# Altium project Dragonquad.PrjPCB
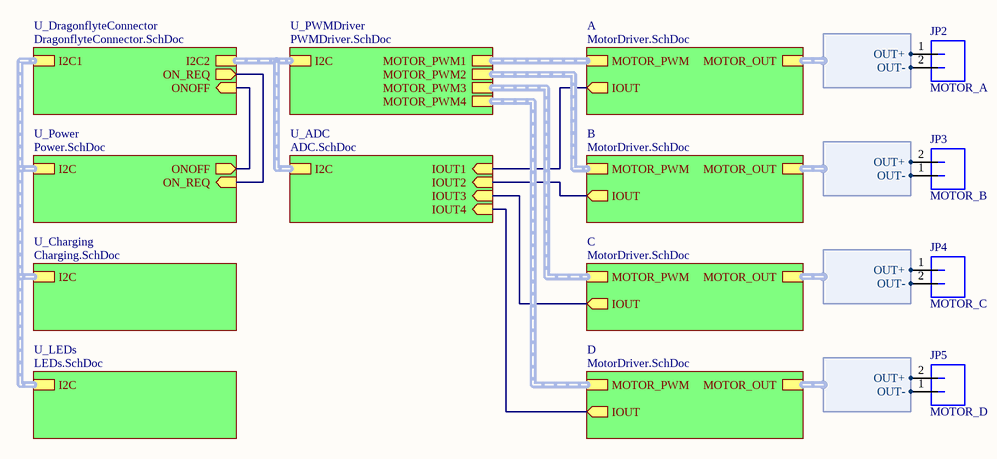
[diagram p0: Dragonquad.SchDoc]
8 sheets, 79 parts. Net scope: hierarchical (ports join the sheet entries above them; power ports are global).
Board file: Dragonquad.PcbDoc
Sheets:
  Dragonquad.SchDoc
    U_Power = Power.SchDoc
    U_DragonflyteConnector = DragonflyteConnector.SchDoc
    U_LEDs = LEDs.SchDoc
    U_PWMDriver = PWMDriver.SchDoc
    U_ADC = ADC.SchDoc
    U_Charging = Charging.SchDoc
    A = MotorDriver.SchDoc
    B = MotorDriver.SchDoc
    C = MotorDriver.SchDoc
    D = MotorDriver.SchDoc

## Sheet Dragonquad.SchDoc
size A

### Parts
JP2  MOTOR_A  [MOLEX-PICOBLADE-1.25MM-2-HORZ-SMD]
JP3  MOTOR_B  [MOLEX-PICOBLADE-1.25MM-2-HORZ-SMD]
JP4  MOTOR_C  [MOLEX-PICOBLADE-1.25MM-2-HORZ-SMD]
JP5  MOTOR_D  [MOLEX-PICOBLADE-1.25MM-2-HORZ-SMD]

### Sub-sheets
A = MotorDriver.SchDoc: MOTOR_PWM (harness MotorPWM), MOTOR_OUT (harness MotorOut), IOUT (out)
B = MotorDriver.SchDoc: MOTOR_PWM (harness MotorPWM), MOTOR_OUT (harness MotorOut), IOUT (out)
C = MotorDriver.SchDoc: MOTOR_PWM (harness MotorPWM), MOTOR_OUT (harness MotorOut), IOUT (out)
D = MotorDriver.SchDoc: MOTOR_PWM (harness MotorPWM), MOTOR_OUT (harness MotorOut), IOUT (out)
U_ADC = ADC.SchDoc: I2C (harness I2C), IOUT1 (in), IOUT2 (in), IOUT3 (in), IOUT4 (in)
U_Charging = Charging.SchDoc: I2C (harness I2C)
U_DragonflyteConnector = DragonflyteConnector.SchDoc: ONOFF (in), ON_REQ (out), I2C1 (harness I2C), I2C2 (harness I2C)
U_LEDs = LEDs.SchDoc: I2C (harness I2C)
U_Power = Power.SchDoc: ONOFF (out), ON_REQ (in), I2C (harness I2C)
U_PWMDriver = PWMDriver.SchDoc: I2C (harness I2C), MOTOR_PWM1 (harness MotorPWM), MOTOR_PWM2 (harness MotorPWM), MOTOR_PWM3 (harness MotorPWM), MOTOR_PWM4 (harness MotorPWM)

### Harnesses
MotorOut: OUT+, OUT-

### Nets
NetD6_1: sheet U_Power/ONOFF, sheet U_DragonflyteConnector/ONOFF
NetJP1_30: sheet U_Power/ON_REQ, sheet U_DragonflyteConnector/ON_REQ
NetJP2_1: JP2.1 ; sheet A/MOTOR_OUT.OUT+
NetJP2_2: JP2.2 ; sheet A/MOTOR_OUT.OUT-
NetJP3_1: JP3.1 ; sheet B/MOTOR_OUT.OUT-
NetJP3_2: JP3.2 ; sheet B/MOTOR_OUT.OUT+
NetJP4_1: JP4.1 ; sheet C/MOTOR_OUT.OUT+
NetJP4_2: JP4.2 ; sheet C/MOTOR_OUT.OUT-
NetJP5_1: JP5.1 ; sheet D/MOTOR_OUT.OUT-
NetJP5_2: JP5.2 ; sheet D/MOTOR_OUT.OUT+
NetR6_A_2: sheet U_ADC/IOUT1, sheet A/IOUT
NetR6_B_2: sheet U_ADC/IOUT2, sheet B/IOUT
NetR6_C_2: sheet U_ADC/IOUT3, sheet C/IOUT
NetR6_D_2: sheet U_ADC/IOUT4, sheet D/IOUT

### Buses and harness runs
harness sheet A/MOTOR_PWM = sheet U_PWMDriver/MOTOR_PWM1
harness sheet B/MOTOR_PWM = sheet U_PWMDriver/MOTOR_PWM2
harness sheet C/MOTOR_PWM = sheet U_PWMDriver/MOTOR_PWM3
harness sheet D/MOTOR_PWM = sheet U_PWMDriver/MOTOR_PWM4
harness sheet U_ADC/I2C = sheet U_DragonflyteConnector/I2C2 = sheet U_PWMDriver/I2C
harness sheet U_Charging/I2C = sheet U_DragonflyteConnector/I2C1 = sheet U_LEDs/I2C = sheet U_Power/I2C

### Library data of the parts
JP2-JP5 = MOLEX_PICOBLADE_1.25MM_2_HORZ_SMD: Manufacturer: Molex; PartNumber: 53261-0271; Mounting Technology: Surface Mount; PackageReference: PicoBlade-1.25mm

## Sheet Power.SchDoc
size A
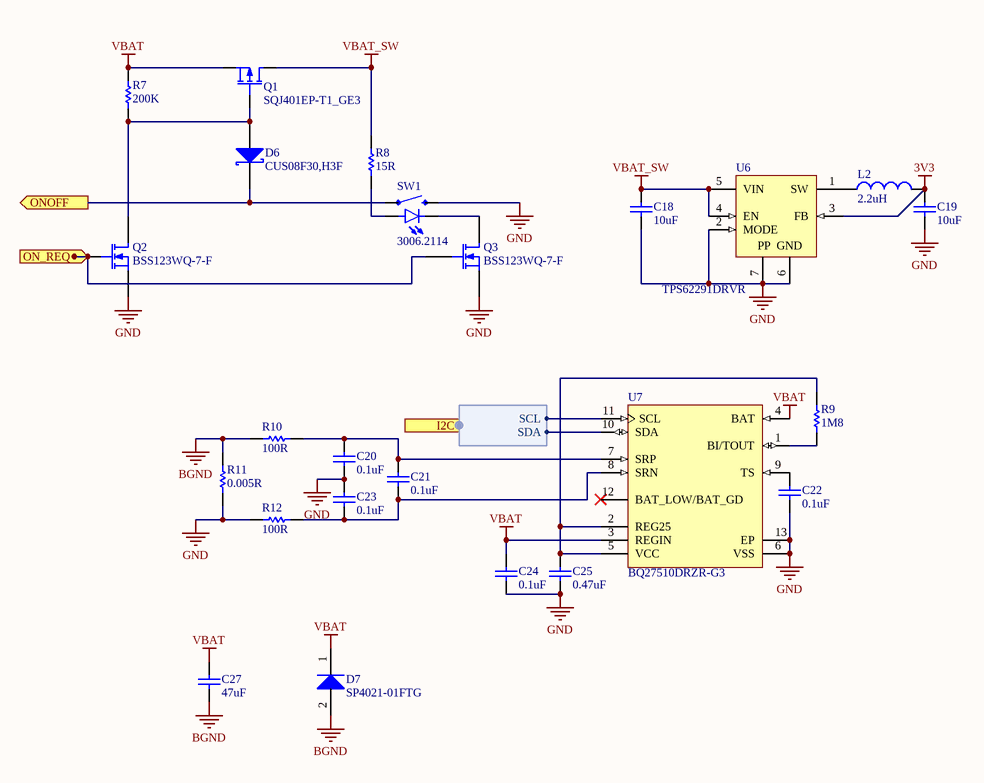
[diagram p1: Power.SchDoc]

### Parts
C18  value 10uF  [C0402[1005X55]]  (hidden comment: 10uF 6.3V 0402)
C19  value 10uF  [C0402[1005X55]]  (hidden comment: 10uF 6.3V 0402)
C20  value 0.1uF  [C0402[1005X55]]  (hidden comment: 0.1uF 6.3V 0402)
C21  value 0.1uF  [C0402[1005X55]]  (hidden comment: 0.1uF 6.3V 0402)
C22  value 0.1uF  [C0402[1005X55]]  (hidden comment: 0.1uF 6.3V 0402)
C23  value 0.1uF  [C0402[1005X55]]  (hidden comment: 0.1uF 6.3V 0402)
C24  value 0.1uF  [C0402[1005X55]]  (hidden comment: 0.1uF 6.3V 0402)
C25  value 0.47uF  [C0402[1005X55]]  (hidden comment: 0.47uF 25V 0402)
C27  value 47uF  [C1206[3216X160]]  (hidden comment: 47uF 6.3V 1206)
D6  CUS08F30,H3F  [SOD-323]
D7  SP4021-01FTG  [SOD-323]
L2  2.2uH  [IND0805]
Q1  SQJ401EP-T1_GE3  [PowerPak-8]
Q2  BSS123WQ-7-F  [SOT323-3]
Q3  BSS123WQ-7-F  [SOT323-3]
R7  value 200K  [R0402[1005]]  (hidden comment: 200K 1% 0402)
R8  value 15R  [R0402[1005]]  (hidden comment: 15R 1% 0402)
R9  value 1M8  [R0402[1005]]  (hidden comment: 1M8 1% 0402)
R10  value 100R  [R0402[1005]]  (hidden comment: 100R 1% 0402)
R11  value 0.005R  [R2512[6432]]  (hidden comment: 0.005R 1% 2512)
R12  value 100R  [R0402[1005]]  (hidden comment: 100R 1% 0402)
SW1  3006.2114  [PCBComponent_1]
U6  TPS62291DRVR  [WSON-6]
U7  BQ27510DRZR-G3  [VSON-12]

### Ports
I2C (harness I2C), ON_REQ (in), ONOFF (out)

### Harnesses
I2C: SCL, SDA

### Nets
3V3: C19.2 L2.2 U6.3(FB)
BGND: C27.1 D7.2(A) R10.1 R11.2
GND: C18.1 C19.1 C20.1 C22.1 C23.2 C24.1 C25.1 Q2.2(S) Q3.2(S) R11.1 R12.1 SW1.2 U6.2(MODE) U6.6(GND) U6.7(EP) U7.6(VSS) U7.13(EP)
VBAT: C24.2 C27.2 D7.1(K) Q1.1(S) R7.2 U7.3(REGIN) U7.4(BAT)
VBAT_SW: C18.2 Q1.3(D) R8.2 U6.4(EN) U6.5(VIN)
NetC20_2: C20.2 C21.2 R10.2 U7.7(SRP)
NetC21_1: C21.1 C23.1 R12.2 U7.8(SRN)
NetC22_2: C22.2 U7.9(TS)
NetC25_2: C25.2 R9.2 U7.2(REG25) U7.5(VCC)
NetD6_1: D6.1(K) SW1.1 ; port ONOFF
NetD6_2: D6.2(A) Q1.2(G) Q2.3(D) R7.1
NetJP1_30: Q2.1(G) Q3.1(G) ; port ON_REQ
NetJP1_33: U7.11(SCL) ; port I2C.SCL
NetJP1_34: U7.10(SDA) ; port I2C.SDA
NetL2_1: L2.1 U6.1(SW)
NetQ3_3: Q3.3(D) SW1.K
NetR8_1: R8.1 SW1.A
NetR9_1: R9.1 U7.1(BI/TOUT)

Not connected (* = marked no-connect by the designer): U7 12(BAT_LOW/BAT_GD)*

### Notes on the sheet
- (in symbol TPS62291DRVR) PP

### Library data of the parts
C18 C19 = CAP_10uF_6.3V_0402_20%: 10uF 6.3V 20% 0402 (1005 Metric); PartNumber: GRM155R60J106ME44D; Manufacturer: Murata; Tolerance: 20%; Mounting Technology: Surface Mount; PackageReference: 0402; PackageDescription: 0402 (1005 Metric); Voltage: 6.3V
C20-C24 = CAP_0.1uF_6.3V_0402_10%: 0.1uF 6.3V 10% 0402 (1005 Metric); PartNumber: GRM155R70J104KA01D; Manufacturer: Murata; Mounting Technology: Surface Mount; PackageReference: 0402; PackageDescription: 0402 (1005 Metric); Voltage: 6.3V; Tolerance: 10%
C25 = CAP_0.47uF_25V_0402_10%: 0.47uF 25V 10% 0402 (1005 Metric); PartNumber: GRM155R61E474KE01D; Manufacturer: Murata; Mounting Technology: Surface Mount; PackageReference: 0402; PackageDescription: 0402 (1005 Metric); Voltage: 25V; Tolerance: 10%
C27 = CAP_47uF_6.3V_1206_10%: 47uF 6.3V 10% 1206 (3216 Metric); PartNumber: GRM31CR60J476KE19L; Manufacturer: Murata; Mounting Technology: Surface Mount; PackageReference: 1206; PackageDescription: 1206 (3216 Metric); Voltage: 6.3V; Tolerance: 10%
D6 = CUS08F30,H3F: Manufacturer: Toshiba; PackageReference: SOD-323; PartNumber: CUS08F30,H3F; Mounting Technology: Surface Mount
D7 = SP4021-01FTG: Manufacturer: Littelfuse; PartNumber: SP4021-01FTG; PackageReference: SOD-323-2; Mounting Technology: Surface Mount
L2 = IND_2.2uH_1.7A_0805_20%: 2.2uH 20% 1.7A 0805; PartNumber: LQM21PN2R2MGHL; Manufacturer: Murata; PackageReference: 0805; PackageDescription: 0805 (2012 metric); Value: 2.2uH; Mounting Technology: Surface Mount; Current: 1.7A
Q1 = SQJ401EP-T1_GE3: P-Channel MOSFET; Manufacturer: Vishay; PartNumber: SQJ401EP-T1_GE3; Mounting Technology: Surface Mount; PackageReference: PowerPAK SO-8
Q2 Q3 = BSS123WQ-7-F: N-Channel MOSFET; Manufacturer: Diodes Incorporated; PartNumber: BSS123WQ-7-F; PackageReference: SOT-323-3; Mounting Technology: Surface Mount
R7 = RES_200K_0402_1%: 200K 0.063W 1% 0402 (1005 Metric); Manufacturer: KOA Speer; PartNumber: RK73H1ETTP2003F; Tolerance: 1%; Power: 0.063W; Mounting Technology: Surface Mount; PackageReference: 0402; PackageDescription: 0402 (1005 Metric); ComponentLink1Description: Datasheet; ComponentLink1URL: http://www.koaspeer.com/catimages/Products/RK73H/RK73H.pdf
R8 = RES_15R_0402_1%: 15R 0.063W 1% 0402 (1005 Metric); Manufacturer: KOA Speer; PartNumber: RK73H1ETTP15R0F; Tolerance: 1%; Power: 0.063W; Mounting Technology: Surface Mount; PackageReference: 0402; PackageDescription: 0402 (1005 Metric); ComponentLink1Description: Datasheet; ComponentLink1URL: http://www.koaspeer.com/catimages/Products/RK73H/RK73H.pdf
R9 = RES_1M8_0402_1%: 1M8 0.063W 1% 0402 (1005 Metric); Manufacturer: KOA Speer; PartNumber: RK73H1ETTP1804F; Tolerance: 1%; Power: 0.063W; Mounting Technology: Surface Mount; PackageReference: 0402; PackageDescription: 0402 (1005 Metric); ComponentLink1Description: Datasheet; ComponentLink1URL: http://www.koaspeer.com/catimages/Products/RK73H/RK73H.pdf
R10 R12 = RES_100R_0402_1%: 100R 0.063W 1% 0402 (1005 Metric); Manufacturer: KOA Speer; PartNumber: RK73H1ETTP1000F; Tolerance: 1%; Power: 0.063W; Mounting Technology: Surface Mount; PackageReference: 0402; PackageDescription: 0402 (1005 Metric); ComponentLink1Description: Datasheet; ComponentLink1URL: http://www.koaspeer.com/catimages/Products/RK73H/RK73H.pdf
R11 = RES_0.005R_2512_1%: 0.005R 2.5W 1% 2512 (6432 Metric); Manufacturer: Riedon; PartNumber: CSR2512B0R005F; Tolerance: 1%; Power: 2.5W; Mounting Technology: Surface Mount; PackageReference: 2512; PackageDescription: 2512 (6432 Metric); ComponentLink1Description: Datasheet; ComponentLink1URL: https://industrial.panasonic.com/cdbs/www-data/pdf/RDA0000/AOA0000C239.pdf
SW1 = 3006.2114: Manufacturer: Marquadt; PartNumber: 3006.2114; Mounting Technology: Surface Mount
U6 = TPS62291DRVR: Voltage Regulators - Switching Regulators 2.25MHz 1A Step-Down Cnvrtr 3.3V Output; Manufacturer: Texas Instruments; PartNumber: TPS62291DRVR; PackageReference: WSON-6; PackageDescription: SON, 6-Leads, Body 2x2mm, Pitch 0.65mm, Thermal Pad 1.6x1mm, TI Recommended; Mounting Technology: Surface Mount
U7 = BQ27510DRZR-G3: Battery Management System-Side Impedance Track Fuel Gauge; Manufacturer: Texas Instruments; PartNumber: BQ27510DRZR-G3; PackageReference: VSON-12; Mounting Technology: Surface Mount

## Sheet DragonflyteConnector.SchDoc
size A
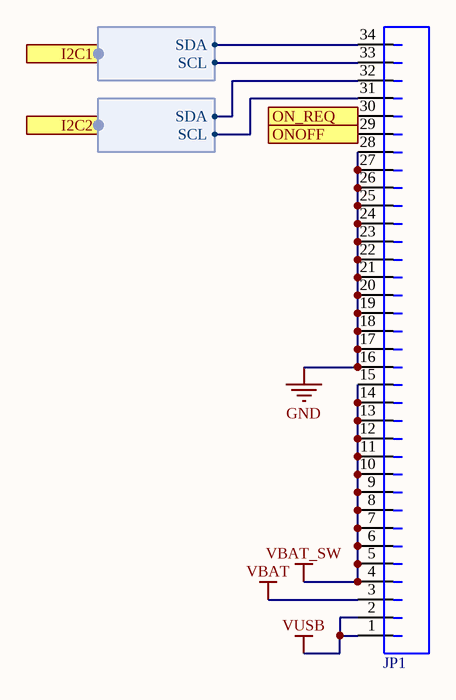
[diagram p2: DragonflyteConnector.SchDoc]

### Parts
JP1  MOLEX_FFC-FPC_34  [MOLEX-FFC-FPC-0.5MM-34]  (value not drawn)

### Ports
I2C1 (harness I2C), I2C2 (harness I2C), ON_REQ (out), ONOFF (in)

### Harnesses
I2C: SCL, SDA

### Nets
GND: JP1.16 JP1.17 JP1.18 JP1.19 JP1.20 JP1.21 JP1.22 JP1.23 JP1.24 JP1.25 JP1.26 JP1.27 JP1.28
VBAT: JP1.3
VBAT_SW: JP1.4 JP1.5 JP1.6 JP1.7 JP1.8 JP1.9 JP1.10 JP1.11 JP1.12 JP1.13 JP1.14 JP1.15
VUSB: JP1.1 JP1.2
NetD6_1: JP1.29 ; port ONOFF
NetJP1_30: JP1.30 ; port ON_REQ
NetJP1_31: JP1.31 ; port I2C2.SCL
NetJP1_32: JP1.32 ; port I2C2.SDA
NetJP1_33: JP1.33 ; port I2C1.SCL
NetJP1_34: JP1.34 ; port I2C1.SDA

### Library data of the parts
JP1 = MOLEX_FFC-FPC_34: Manufacturer: Molex; PartNumber: 51296-3494; System: Connector; PackageReference: FFC-FPC-0.5; Mounting Technology: Surface Mount

## Sheet LEDs.SchDoc
size A
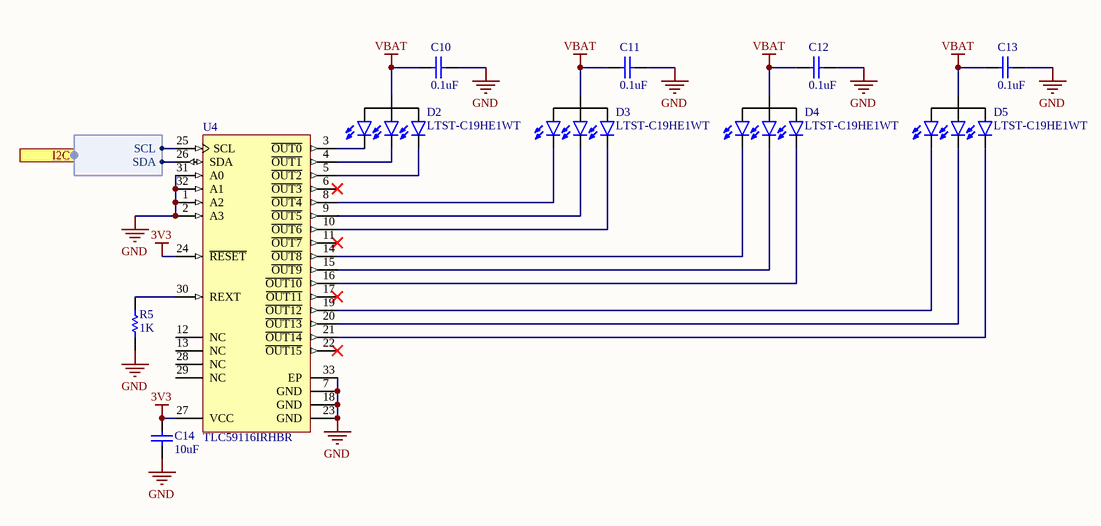
[diagram p3: LEDs.SchDoc]

### Parts
C10  value 0.1uF  [C0402[1005X55]]  (hidden comment: 0.1uF 6.3V 0402)
C11  value 0.1uF  [C0402[1005X55]]  (hidden comment: 0.1uF 6.3V 0402)
C12  value 0.1uF  [C0402[1005X55]]  (hidden comment: 0.1uF 6.3V 0402)
C13  value 0.1uF  [C0402[1005X55]]  (hidden comment: 0.1uF 6.3V 0402)
C14  value 10uF  [C0402[1005X55]]  (hidden comment: 10uF 6.3V 0402)
D2  LTST-C19HE1WT  [LED0606]
D3  LTST-C19HE1WT  [LED0606]
D4  LTST-C19HE1WT  [LED0606]
D5  LTST-C19HE1WT  [LED0606]
R5  value 1K  [R0402[1005]]  (hidden comment: 1K 1% 0402)
U4  TLC59116IRHBR  [VQFN-32]

### Ports
I2C (harness I2C)

### Harnesses
I2C: SCL, SDA

### Nets
3V3: C14.2 U4.24(~{RESET}) U4.27(VCC)
GND: C10.2 C11.2 C12.2 C13.2 C14.1 R5.1 U4.1(A2) U4.2(A3) U4.7(GND) U4.18(GND) U4.23(GND) U4.31(A0) U4.32(A1) U4.33(EP)
VBAT: C10.1 C11.1 C12.1 C13.1 D2.4(A) D3.4(A) D4.4(A) D5.4(A)
NetD2_1: D2.1(K_Red) U4.3(~{OUT0})
NetD2_2: D2.2(K_Green) U4.4(~{OUT1})
NetD2_3: D2.3(K_Blue) U4.5(~{OUT2})
NetD3_1: D3.1(K_Red) U4.8(~{OUT4})
NetD3_2: D3.2(K_Green) U4.9(~{OUT5})
NetD3_3: D3.3(K_Blue) U4.10(~{OUT6})
NetD4_1: D4.1(K_Red) U4.14(~{OUT8})
NetD4_2: D4.2(K_Green) U4.15(~{OUT9})
NetD4_3: D4.3(K_Blue) U4.16(~{OUT10})
NetD5_1: D5.1(K_Red) U4.19(~{OUT12})
NetD5_2: D5.2(K_Green) U4.20(~{OUT13})
NetD5_3: D5.3(K_Blue) U4.21(~{OUT14})
NetJP1_33: U4.25(SCL) ; port I2C.SCL
NetJP1_34: U4.26(SDA) ; port I2C.SDA
NetR5_2: R5.2 U4.30(REXT)

Not connected (* = marked no-connect by the designer): U4 6(~{OUT3})* 11(~{OUT7})* 12(NC) 13(NC) 17(~{OUT11})* 22(~{OUT15})* 28(NC) 29(NC)

### Library data of the parts
C10-C13 = CAP_0.1uF_6.3V_0402_10%: as C20 on sheet Power; Mounting Technology: Surface Mount; PackageReference: 0402; PackageDescription: 0402 (1005 Metric); Voltage: 6.3V; Tolerance: 10%
C14 = CAP_10uF_6.3V_0402_20%: as C18 on sheet Power; Mounting Technology: Surface Mount; PackageReference: 0402; PackageDescription: 0402 (1005 Metric); Voltage: 6.3V; Tolerance: 20%
D2-D5 = LTST-C19HE1WT: Manufacturer: Lite-On Inc.; PartNumber: LTST-C19HE1WT; PackageReference: 0606; Mounting Technology: Surface Mount; PackageDescription: 0606 (1616 Metric)
R5 = RES_1K_0402_1%: 1K 0.063W 1% 0402 (1005 Metric); Manufacturer: KOA Speer; PartNumber: RK73H1ETTP1001F; Tolerance: 1%; Power: 0.063W; Mounting Technology: Surface Mount; PackageReference: 0402; PackageDescription: 0402 (1005 Metric); ComponentLink1Description: Datasheet; ComponentLink1URL: http://www.koaspeer.com/catimages/Products/RK73H/RK73H.pdf
U4 = TLC59116IRHBR: IC LED DRVR LIN DIM 120MA 32VQFN; Manufacturer: Texas Instruments; PartNumber: TLC59116IRHBR; PackageReference: QFN-32; Mounting Technology: Surface Mount

## Sheet PWMDriver.SchDoc
size A
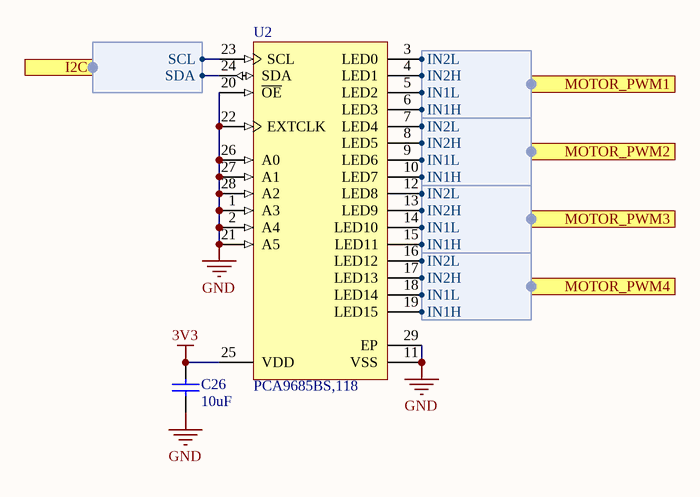
[diagram p4: PWMDriver.SchDoc]

### Parts
C26  value 10uF  [C0402[1005X55]]  (hidden comment: 10uF 6.3V 0402)
U2  PCA9685BS,118  [VQFN-28]

### Ports
I2C (harness I2C), MOTOR_PWM1 (harness MotorPWM), MOTOR_PWM2 (harness MotorPWM), MOTOR_PWM3 (harness MotorPWM), MOTOR_PWM4 (harness MotorPWM)

### Harnesses
I2C: SCL, SDA
MotorPWM: IN1H, IN1L, IN2H, IN2L

### Nets
3V3: C26.2 U2.25(VDD)
GND: C26.1 U2.1(A3) U2.2(A4) U2.11(VSS) U2.20(~{OE}) U2.21(A5) U2.22(EXTCLK) U2.26(A0) U2.27(A1) U2.28(A2) U2.29(EP)
NetJP1_31: U2.23(SCL) ; port I2C.SCL
NetJP1_32: U2.24(SDA) ; port I2C.SDA
NetU2_3: U2.3(LED0) ; port MOTOR_PWM1.IN2L
NetU2_4: U2.4(LED1) ; port MOTOR_PWM1.IN2H
NetU2_5: U2.5(LED2) ; port MOTOR_PWM1.IN1L
NetU2_6: U2.6(LED3) ; port MOTOR_PWM1.IN1H
NetU2_7: U2.7(LED4) ; port MOTOR_PWM2.IN2L
NetU2_8: U2.8(LED5) ; port MOTOR_PWM2.IN2H
NetU2_9: U2.9(LED6) ; port MOTOR_PWM2.IN1L
NetU2_10: U2.10(LED7) ; port MOTOR_PWM2.IN1H
NetU2_12: U2.12(LED8) ; port MOTOR_PWM3.IN2L
NetU2_13: U2.13(LED9) ; port MOTOR_PWM3.IN2H
NetU2_14: U2.14(LED10) ; port MOTOR_PWM3.IN1L
NetU2_15: U2.15(LED11) ; port MOTOR_PWM3.IN1H
NetU2_16: U2.16(LED12) ; port MOTOR_PWM4.IN2L
NetU2_17: U2.17(LED13) ; port MOTOR_PWM4.IN2H
NetU2_18: U2.18(LED14) ; port MOTOR_PWM4.IN1L
NetU2_19: U2.19(LED15) ; port MOTOR_PWM4.IN1H

### Library data of the parts
C26 = CAP_10uF_6.3V_0402_20%: as C18 on sheet Power; Mounting Technology: Surface Mount; PackageReference: 0402; PackageDescription: 0402 (1005 Metric); Voltage: 6.3V; Tolerance: 20%
U2 = PCA9685BS,118: IC LED DRVR LIN DIM 25MA 28HVQFN; Manufacturer: NXP; PartNumber: PCA9685BS,118; PackageReference: QFN-28; Mounting Technology: Surface Mount

## Sheet ADC.SchDoc
size A
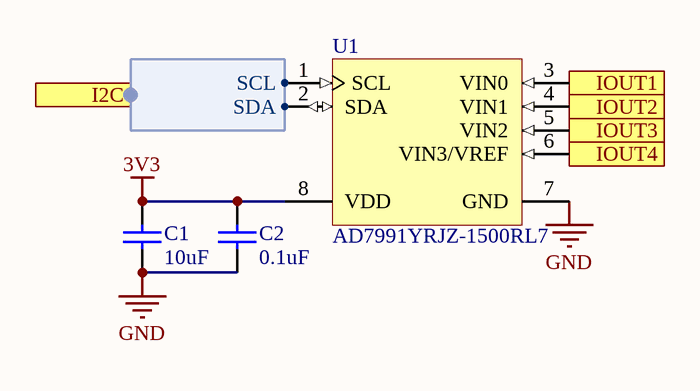
[diagram p5: ADC.SchDoc]

### Parts
C1  value 10uF  [C0402[1005X55]]  (hidden comment: 10uF 6.3V 0402)
C2  value 0.1uF  [C0402[1005X55]]  (hidden comment: 0.1uF 6.3V 0402)
U1  AD7991YRJZ-1500RL7  [RJ-8_M]

### Ports
I2C (harness I2C), IOUT1 (in), IOUT2 (in), IOUT3 (in), IOUT4 (in)

### Harnesses
I2C: SCL, SDA

### Nets
3V3: C1.2 C2.2 U1.8(VDD)
GND: C1.1 C2.1 U1.7(GND)
NetJP1_31: U1.1(SCL) ; port I2C.SCL
NetJP1_32: U1.2(SDA) ; port I2C.SDA
NetR6_A_2: U1.3(VIN0) ; port IOUT1
NetR6_B_2: U1.4(VIN1) ; port IOUT2
NetR6_C_2: U1.5(VIN2) ; port IOUT3
NetR6_D_2: U1.6(VIN3/VREF) ; port IOUT4

### Library data of the parts
C1 = CAP_10uF_6.3V_0402_20%: as C18 on sheet Power; Mounting Technology: Surface Mount; PackageReference: 0402; PackageDescription: 0402 (1005 Metric); Voltage: 6.3V; Tolerance: 20%
C2 = CAP_0.1uF_6.3V_0402_10%: as C20 on sheet Power; Mounting Technology: Surface Mount; PackageReference: 0402; PackageDescription: 0402 (1005 Metric); Voltage: 6.3V; Tolerance: 10%
U1 = CMP-0313-01614-2: Quad 12-Bit Analog-to-Digital Converter with I2C, Serial 2-Wire Interface, 140KSPS, -40 to +125 degC, RJ-8, Pb-Free, Reel; Generic Part Number: AD7991; Manufacturer: Analog Devices; Resolution (Bits): 12; Throughput Rate (SPS): 140K; Channels: 4; Interface: I2C/Ser 2-Wire; DatasheetVersion: Rev.B; ComponentLink1Description: Manufacturer URL; ComponentLink3Description: Package Specification; ComponentLink1URL: http://www.analog.com/en/index.html; ComponentLink2URL: http://www.analog.com/static/imported-files/data_sheets/AD7991_7995_7999.pdf; ComponentLink4Description: Product URL; Code_JEDEC: MO-178-BA; PartNumber: AD7991YRJZ-1500RL7; Mounting Technology: Surface Mount; PackageReference: RJ-8; PackageDescription: 8-Lead Thin Small Outline Transistor Package [SOT-23]; ComponentLink4URL: http://www.analog.com/en/analog-to-digital-converters/ad-converters/ad7991/products/product.html; Packing: Reel; PackageVersion: 121608-A; RoHS: Y; ComponentLink3URL: http://www.analog.com/static/imported-files/packages/PKG_PDF/SOT-23(RJ)/RJ_8.pdf; ComponentLink2Description: Datasheet

## Sheet Charging.SchDoc
size A
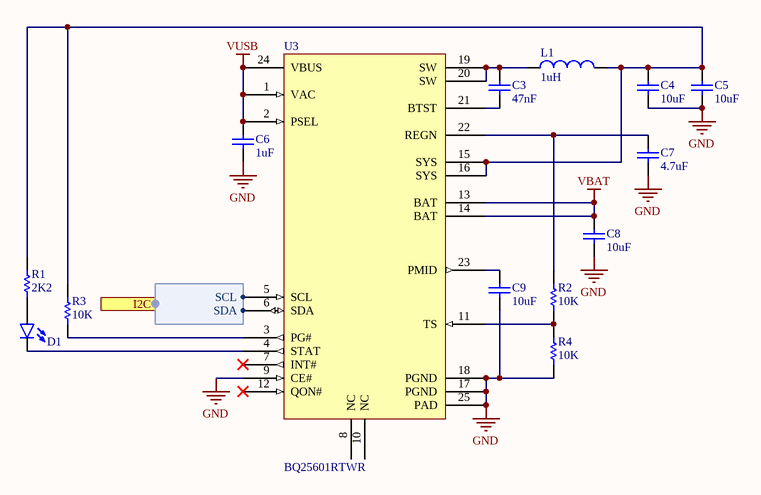
[diagram p6: Charging.SchDoc]

### Parts
C3  value 47nF  [C0402[1005X55]]  (hidden comment: 47nF 16V 0402)
C4  value 10uF  [C0402[1005X55]]  (hidden comment: 10uF 6.3V 0402)
C5  value 10uF  [C0402[1005X55]]  (hidden comment: 10uF 6.3V 0402)
C6  value 1uF  [C0402[1005X55]]  (hidden comment: 1uF 16V 0402)
C7  value 4.7uF  [C0402[1005X55]]  (hidden comment: 4.7uF 10V 0402)
C8  value 10uF  [C0402[1005X55]]  (hidden comment: 10uF 6.3V 0402)
C9  value 10uF  [C0603[1608X92]]  (hidden comment: 10uF 35V 0603)
D1  LED_0603_GREEN_5mA  [LED0603]  (value not drawn)
L1  1uH  [IND1008]
R1  value 2K2  [R0402[1005]]  (hidden comment: 2K2 1% 0402)
R2  value 10K  [R0402[1005]]  (hidden comment: 10K 1% 0402)
R3  value 10K  [R0402[1005]]  (hidden comment: 10K 1% 0402)
R4  value 10K  [R0402[1005]]  (hidden comment: 10K 1% 0402)
U3  BQ25601RTWR  [WQFN-24]

### Ports
I2C (harness I2C)

### Harnesses
I2C: SCL, SDA

### Nets
GND: C4.1 C5.1 C6.1 C7.1 C8.1 C9.1 R4.1 U3.9(CE#) U3.17(PGND) U3.18(PGND) U3.25(PAD)
VBAT: C8.2 U3.13(BAT) U3.14(BAT)
VUSB: C6.2 U3.1(VAC) U3.2(PSEL) U3.24(VBUS)
NetC3_1: C3.1 U3.21(BTST)
NetC3_2: C3.2 L1.1 U3.19(SW) U3.20(SW)
NetC4_2: C4.2 C5.2 L1.2 R1.2 R3.2 U3.15(SYS) U3.16(SYS)
NetC7_2: C7.2 R2.2 U3.22(REGN)
NetC9_2: C9.2 U3.23(PMID)
NetD1_A: D1.A R1.1
NetD1_C: D1.C U3.4(STAT)
NetJP1_33: U3.5(SCL) ; port I2C.SCL
NetJP1_34: U3.6(SDA) ; port I2C.SDA
NetR2_1: R2.1 R4.2 U3.11(TS)
NetR3_1: R3.1 U3.3(PG#)

Not connected (* = marked no-connect by the designer): U3 7(INT#)* 8(NC) 10(NC) 12(QON#)*

### Library data of the parts
C3 = CAP_47nF_16V_0402_10%: 47nF 16V 10% 0402 (1005 Metric); PartNumber: GCM155R71C473KA37D; Manufacturer: Murata; Mounting Technology: Surface Mount; PackageReference: 0402; PackageDescription: 0402 (1005 Metric); Voltage: 16V; Tolerance: 10%
C4 C5 C8 = CAP_10uF_6.3V_0402_20%: as C18 on sheet Power; Mounting Technology: Surface Mount; PackageReference: 0402; PackageDescription: 0402 (1005 Metric); Voltage: 6.3V; Tolerance: 20%
C6 = CAP_1uF_16V_0402_10%: 1uF 16V 10% 0402 (1005 Metric); PartNumber: GRM155R61C105KE01D; Manufacturer: Murata; Mounting Technology: Surface Mount; PackageReference: 0402; PackageDescription: 0402 (1005 Metric); Voltage: 16V; Tolerance: 10%
C7 = CAP_4.7uF_10V_0402_10%: 4.7uF 10V 10% 0402 (1005 Metric); PartNumber: ZRB15XR61A475KE01D; Manufacturer: Murata; Mounting Technology: Surface Mount; PackageReference: 0402; PackageDescription: 0402 (1005 Metric); Voltage: 10V; Tolerance: 10%
C9 = CAP_10uF_35V_0603_10%: 10uF 35V 10% 0603 (1608 Metric); PartNumber: GRM188R6YA106MA73D; Manufacturer: Murata; Mounting Technology: Surface Mount; PackageReference: 0603; PackageDescription: 0603 (1608 Metric); Voltage: 35V; Tolerance: 10%
D1 = LED_0603_GREEN_5mA: PartNumber: LTST-C193TGKT-5A; Manufacturer: Lite-On Inc.; PackageReference: 0603; PackageDescription: 0603 (1608 Metric); Mounting Technology: Surface Mount
L1 = IND_1uH_4.7A_1008_20%: 1uH 20% 4.7A 1008; PartNumber: DFE252012F-2R2M=P2; Manufacturer: Murata; PackageReference: 1008; PackageDescription: 1008 (2520 metric); Mounting Technology: Surface Mount; Current: 4.7A; Value: 1uH
R1 = RES_2K2_0402_1%: 2K2 0.063W 1% 0402 (1005 Metric); Manufacturer: KOA Speer; PartNumber: RK73H1ETTP2201F; Tolerance: 1%; Power: 0.063W; Mounting Technology: Surface Mount; PackageReference: 0402; PackageDescription: 0402 (1005 Metric); ComponentLink1Description: Datasheet; ComponentLink1URL: http://www.koaspeer.com/catimages/Products/RK73H/RK73H.pdf
R2-R4 = RES_10K_0402_1%: 10K 0.063W 1% 0402 (1005 Metric); Manufacturer: KOA Speer; PartNumber: RK73H1ETTP1002F; Tolerance: 1%; Power: 0.063W; Mounting Technology: Surface Mount; PackageReference: 0402; PackageDescription: 0402 (1005 Metric); ComponentLink1Description: Datasheet; ComponentLink1URL: http://www.koaspeer.com/catimages/Products/RK73H/RK73H.pdf
U3 = BQ25601RTWR: Battery Management I2C Controlled Single Cell 3-A Battery Charger with High Input Voltage and Power Path 24-WQFN -40 to 85; Manufacturer: Texas Instruments; PartNumber: Battery Management I2C Controlled Single Cell 3-A Battery Charger with High Input Voltage and Power Path 24-WQFN -40 to 85; PackageReference: WQFN-24; Mounting Technology: Surface Mount

## Sheet MotorDriver.SchDoc
size A
Used 4 times, as channels A, B, C, D. Parts and nets are listed once, with the designators drawn on the sheet.
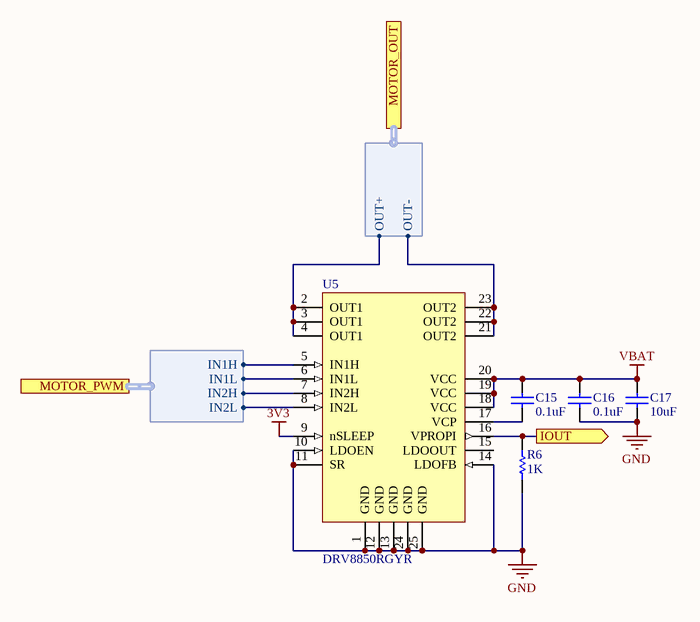
[diagram p7: MotorDriver.SchDoc]

### Parts
C15  value 0.1uF  [C0402[1005X55]]  (hidden comment: 0.1uF 100V 0402)
C16  value 0.1uF  [C0402[1005X55]]  (hidden comment: 0.1uF 6.3V 0402)
C17  value 10uF  [C0402[1005X55]]  (hidden comment: 10uF 6.3V 0402)
R6  value 1K  [R0402[1005]]  (hidden comment: 1K 1% 0402)
U5  DRV8850RGYR  [VQFN-24 (5.5X3.5MM)]

### Ports
IOUT (out), MOTOR_OUT (harness MotorOut), MOTOR_PWM (harness MotorPWM)

### Harnesses
MotorPWM: IN1H, IN1L, IN2H, IN2L
MotorOut: OUT+, OUT-

### Nets
3V3: U5.9(nSLEEP)
GND: C16.1 C17.1 R6.1 U5.1(GND) U5.10(LDOEN) U5.11(SR) U5.12(GND) U5.13(GND) U5.14(LDOFB) U5.24(GND) U5.25(GND)
VBAT: C15.1 C16.2 C17.2 U5.18(VCC) U5.19(VCC) U5.20(VCC)
IOUT: R6.2 U5.16(VPROPI) ; port IOUT
NetC15_2: C15.2 U5.17(VCP)
NetU5_2: U5.2(OUT1) U5.3(OUT1) U5.4(OUT1) ; port MOTOR_OUT.OUT+
NetU5_5: U5.5(IN1H) ; port MOTOR_PWM.IN1H
NetU5_6: U5.6(IN1L) ; port MOTOR_PWM.IN1L
NetU5_7: U5.7(IN2H) ; port MOTOR_PWM.IN2H
NetU5_8: U5.8(IN2L) ; port MOTOR_PWM.IN2L
NetU5_21: U5.21(OUT2) U5.22(OUT2) U5.23(OUT2) ; port MOTOR_OUT.OUT-

Not connected (* = marked no-connect by the designer): U5 15(LDOOUT)

### Channels
A: designators end in _A; ports IOUT=NetR6_A_2
B: designators end in _B; ports IOUT=NetR6_B_2
C: designators end in _C; ports IOUT=NetR6_C_2
D: designators end in _D; ports IOUT=NetR6_D_2

### Library data of the parts
C15 = CAP_0.1uF_100V_0402_10%: 0.1uF 100V 10% 0402 (1005 Metric); PartNumber: GRM155R62A104KE14D; Manufacturer: Murata; Mounting Technology: Surface Mount; PackageReference: 0402; PackageDescription: 0402 (1005 Metric); Voltage: 100V; Tolerance: 10%
C16 = CAP_0.1uF_6.3V_0402_10%: as C20 on sheet Power; Mounting Technology: Surface Mount; PackageReference: 0402; PackageDescription: 0402 (1005 Metric); Voltage: 6.3V; Tolerance: 10%
C17 = CAP_10uF_6.3V_0402_20%: as C18 on sheet Power; Mounting Technology: Surface Mount; PackageReference: 0402; PackageDescription: 0402 (1005 Metric); Voltage: 6.3V; Tolerance: 20%
R6 = RES_1K_0402_1%: as R5 on sheet LEDs; Tolerance: 1%; Power: 0.063W; Mounting Technology: Surface Mount; PackageReference: 0402; PackageDescription: 0402 (1005 Metric); ComponentLink1Description: Datasheet; ComponentLink1URL: http://www.koaspeer.com/catimages/Products/RK73H/RK73H.pdf
U5 = DRV8850RGYR: IC MOTOR DRIVER PAR 24VQFN; Manufacturer: Texas Instruments; PartNumber: DRV8850RGYR; Mounting Technology: Surface Mount; PackageReference: QFN-24

## Nets that join several sheets
3V3: Power (C19.2 L2.2 U6.3), LEDs (C14.2 U4.24 U4.27), PWMDriver (C26.2 U2.25), ADC (C1.2 C2.2 U1.8), A (U5_A.9), B (U5_B.9), C (U5_C.9), D (U5_D.9)
GND: Power (17 pins), DragonflyteConnector (13 pins), LEDs (14 pins), PWMDriver (11 pins), ADC (C1.1 C2.1 U1.7), Charging (11 pins), A (11 pins), B (11 pins), C (11 pins), D (11 pins)
VBAT: Power (7 pins), DragonflyteConnector (JP1.3), LEDs (8 pins), Charging (C8.2 U3.13 U3.14), A (6 pins), B (6 pins), C (6 pins), D (6 pins)
VBAT_SW: Power (5 pins), DragonflyteConnector (12 pins)
VUSB: DragonflyteConnector (JP1.1 JP1.2), Charging (C6.2 U3.1 U3.2 U3.24)
NetD6_1: Power (D6.1 SW1.1), DragonflyteConnector (JP1.29)
NetJP1_30: Power (Q2.1 Q3.1), DragonflyteConnector (JP1.30)
NetJP1_31: DragonflyteConnector (JP1.31), PWMDriver (U2.23), ADC (U1.1)
NetJP1_32: DragonflyteConnector (JP1.32), PWMDriver (U2.24), ADC (U1.2)
NetJP1_33: Power (U7.11), DragonflyteConnector (JP1.33), LEDs (U4.25), Charging (U3.5)
NetJP1_34: Power (U7.10), DragonflyteConnector (JP1.34), LEDs (U4.26), Charging (U3.6)
NetJP2_1: Dragonquad (JP2.1), A (U5_A.2 U5_A.3 U5_A.4)
NetJP2_2: Dragonquad (JP2.2), A (U5_A.21 U5_A.22 U5_A.23)
NetJP3_1: Dragonquad (JP3.1), B (U5_B.21 U5_B.22 U5_B.23)
NetJP3_2: Dragonquad (JP3.2), B (U5_B.2 U5_B.3 U5_B.4)
NetJP4_1: Dragonquad (JP4.1), C (U5_C.2 U5_C.3 U5_C.4)
NetJP4_2: Dragonquad (JP4.2), C (U5_C.21 U5_C.22 U5_C.23)
NetJP5_1: Dragonquad (JP5.1), D (U5_D.21 U5_D.22 U5_D.23)
NetJP5_2: Dragonquad (JP5.2), D (U5_D.2 U5_D.3 U5_D.4)
NetR6_A_2: ADC (U1.3), A (R6_A.2 U5_A.16)
NetR6_B_2: ADC (U1.4), B (R6_B.2 U5_B.16)
NetR6_C_2: ADC (U1.5), C (R6_C.2 U5_C.16)
NetR6_D_2: ADC (U1.6), D (R6_D.2 U5_D.16)
NetU2_3: PWMDriver (U2.3), A (U5_A.8)
NetU2_4: PWMDriver (U2.4), A (U5_A.7)
NetU2_5: PWMDriver (U2.5), A (U5_A.6)
NetU2_6: PWMDriver (U2.6), A (U5_A.5)
NetU2_7: PWMDriver (U2.7), B (U5_B.8)
NetU2_8: PWMDriver (U2.8), B (U5_B.7)
NetU2_9: PWMDriver (U2.9), B (U5_B.6)
NetU2_10: PWMDriver (U2.10), B (U5_B.5)
NetU2_12: PWMDriver (U2.12), C (U5_C.8)
NetU2_13: PWMDriver (U2.13), C (U5_C.7)
NetU2_14: PWMDriver (U2.14), C (U5_C.6)
NetU2_15: PWMDriver (U2.15), C (U5_C.5)
NetU2_16: PWMDriver (U2.16), D (U5_D.8)
NetU2_17: PWMDriver (U2.17), D (U5_D.7)
NetU2_18: PWMDriver (U2.18), D (U5_D.6)
NetU2_19: PWMDriver (U2.19), D (U5_D.5)